# Altium schematic sheet Inductive.SchDoc: WearTech_PMU
size A4; CompanyName: University Of Colorado Boulder; Revision: 1; SheetNumber: 1; SheetTotal: 4
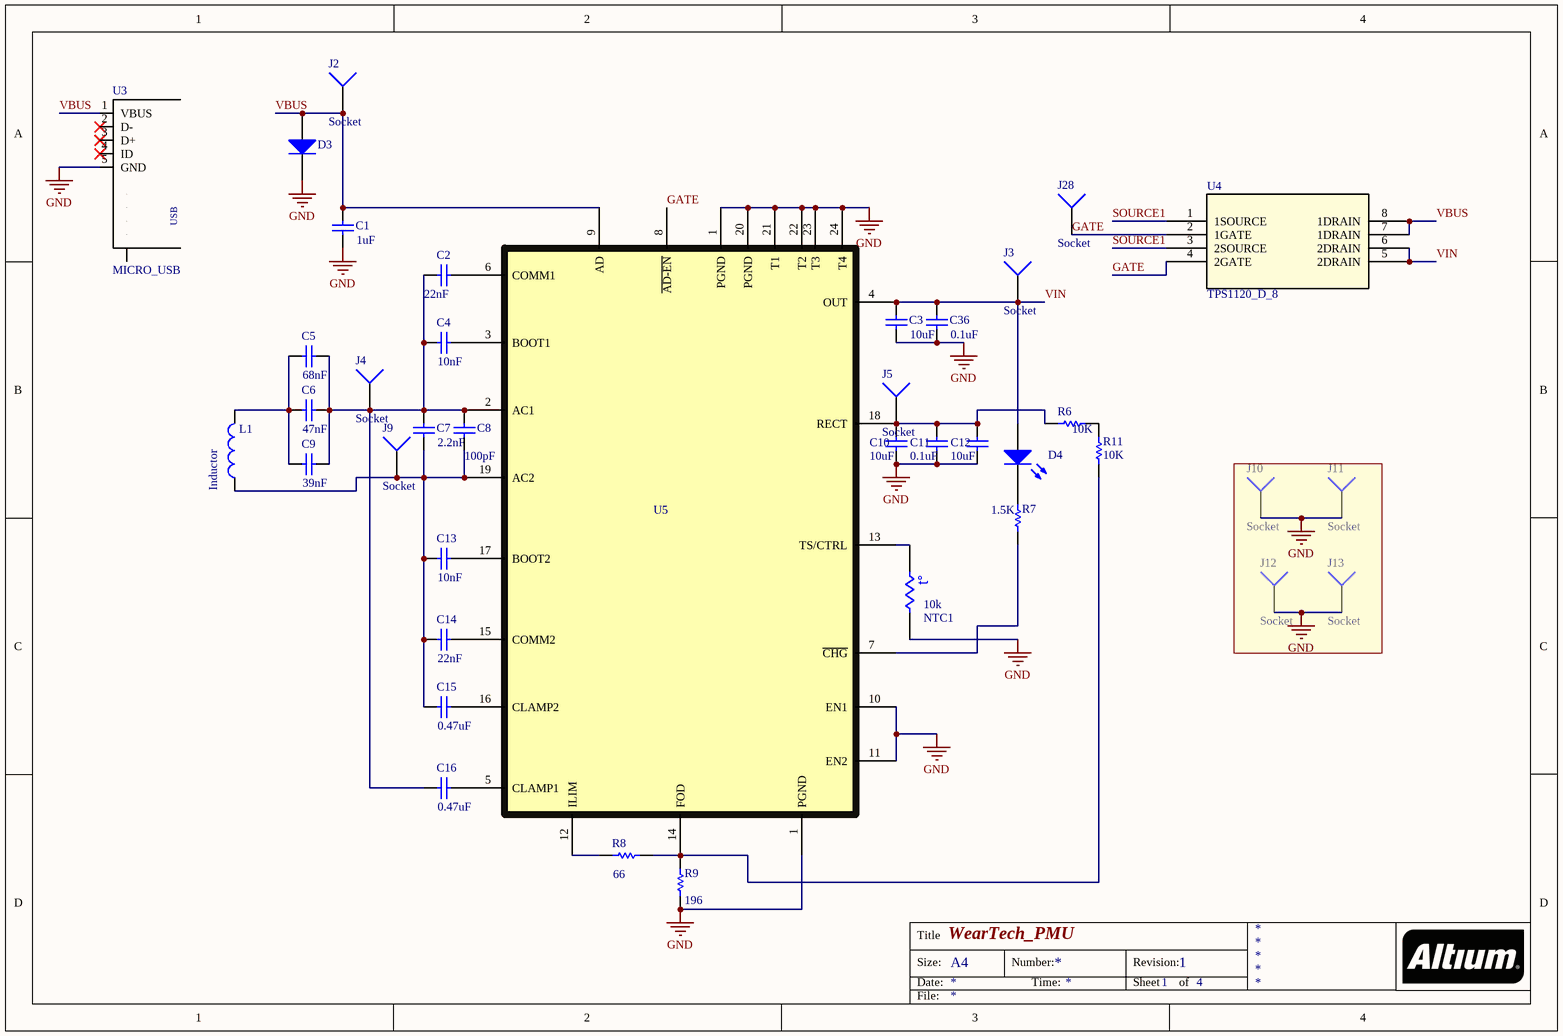
[diagram p0: Inductive.SchDoc]

## Parts
C1  value 1uF  [1608[0603]]  (hidden comment: Cap)
C2  value 22nF  [1608[0603]]  (hidden comment: Cap)
C3  value 10uF  [1608[0603]]  (hidden comment: Cap)
C4  value 10nF  [1608[0603]]  (hidden comment: Cap)
C5  value 68nF  [1608[0603]]  (hidden comment: Cap)
C6  value 47nF  [1608[0603]]  (hidden comment: Cap)
C7  value 2.2nF  [1608[0603]]  (hidden comment: Cap)
C8  value 100pF  [1608[0603]]  (hidden comment: Cap)
C9  value 39nF  [1608[0603]]  (hidden comment: Cap)
C10  value 10uF  [1608[0603]]  (hidden comment: Cap)
C11  value 0.1uF  [1608[0603]]  (hidden comment: Cap)
C12  value 10uF  [1608[0603]]  (hidden comment: Cap)
C13  value 10nF  [1608[0603]]  (hidden comment: Cap)
C14  value 22nF  [1608[0603]]  (hidden comment: Cap)
C15  value 0.47uF  [1608[0603]]  (hidden comment: Cap)
C16  value 0.47uF  [1608[0603]]  (hidden comment: Cap)
C36  value 0.1uF  [1608[0603]]  (hidden comment: Cap)
D3  Diode  [1608[0603]]  (value not drawn)
D4  LED0  [1608[0603]]  (value not drawn)
J2  Socket  [PIN1]
J3  Socket  [PIN1]
J4  Socket  [PIN1]
J5  Socket  [PIN1]
J9  Socket  [PIN1]
J10  Socket  [PIN1]
J11  Socket  [PIN1]
J12  Socket  [PIN1]
J13  Socket  [PIN1]
J28  Socket  [PIN1]
L1  Inductor  [1608[0603]]
NTC1  value 10k  [1608[0603]]  (hidden comment: Res Thermal)
R6  value 10K  [1608[0603]]  (hidden comment: Res1)
R7  value 1.5K  [1608[0603]]  (hidden comment: Res1)
R8  value 66  [1608[0603]]  (hidden comment: Res1)
R9  value 196  [1608[0603]]  (hidden comment: Res1)
R11  value 10K  [1608[0603]]  (hidden comment: Res1)
U3  MICRO_USB  [MICRO USB]
U4  TPS1120_D_8  [BlockSwitch]
U5  BQ51013B  [BQ51013B]  (value not drawn)

## Nets
GND: C1.1 C3.2 C10.2 C11.2 C12.2 C36.2 D3.2(K) J10.1 J11.1 J12.1 J13.1 NTC1.2 R9.2 U3.5(GND) U5.1(PGND) U5.10(EN1) U5.11(EN2) U5.20(PGND) U5.21(T1) U5.22(T2) U5.23(T3) U5.24(T4)
GATE: J28.1 U4.2(1GATE) U4.4(2GATE) U5.8(~{AD-EN})
SOURCE1: U4.1(1SOURCE) U4.3(2SOURCE)
VBUS: C1.2 D3.1(A) J2.1 U3.1(VBUS) U4.7(1DRAIN) U4.8(1DRAIN) U5.9(AD)
VIN: C3.1 C36.1 D4.1(A) J3.1 U4.5(2DRAIN) U4.6(2DRAIN) U5.4(OUT)
NetC2_1: C2.1 U5.6(COMM1)
NetC2_2: C2.2 C4.2 C5.1 C6.1 C7.1 C8.1 C9.1 C16.2 J4.1 U5.2(AC1)
NetC4_1: C4.1 U5.3(BOOT1)
NetC5_2: C5.2 C6.2 C9.2 L1.2
NetC7_2: C7.2 C8.2 C13.2 C14.2 C15.2 J9.1 L1.1 U5.19(AC2)
NetC10_1: C10.1 C11.1 C12.1 J5.1 R6.1 U5.18(RECT)
NetC13_1: C13.1 U5.17(BOOT2)
NetC14_1: C14.1 U5.15(COMM2)
NetC15_1: C15.1 U5.16(CLAMP2)
NetC16_1: C16.1 U5.5(CLAMP1)
NetD4_2: D4.2(K) R7.1
NetNTC1_1: NTC1.1 U5.13(TS/CTRL)
NetR6_2: R6.2 R11.2
NetR7_2: R7.2 U5.7(~{CHG})
NetR8_1: R8.1 U5.12(ILIM)
NetR8_2: R8.2 R9.1 R11.1 U5.14(FOD)

Not connected (* = marked no-connect by the designer): U3 2(D-)* 3(D+)* 4(ID)* M1(S) M2(S) S1(S) S2(S) S3(S) S4(S)

## Notes on the sheet
- Title
- Size:
- Date:
- A4
- Number:
- Time:
- Revision:
- Sheet
- of
- File:
- (in symbol MICRO_USB) USB
- (in symbol Res Thermal) t°

## Library data of the parts
C1 = Cap: Capacitor; Manufacture Part Number: C0603C105K9PACTU; Manufacturer: KEMET; Description: CAP CER 1UF 6.3V X5R 0603; Link: http://psearch.en.murata.com/browser/nosupport/?return=capacitor/product/GRM188R61E105KAAD%23.html; Link: Link; Digi-Key Part Number: 399-7848-1-ND; ComponentLink1URL: Component1URL; ComponentLink1Description: https://search.kemet.com/component-edge/download/datasheet/C0603C105K9PACTU.pdf
C2 C14 = Cap: Capacitor; Manufacture Part Number: CL10B223KA8NNWC; Manufacturer: Samsung Electro-Mechanics; Description: CAP CER 0.022UF 25V X7R 0603; Digi-Key Part Number: 1276-2000-1-ND; ComponentLink1URL: Component1URL; ComponentLink1Description: https://media.digikey.com/pdf/Data%20Sheets/Samsung%20PDFs/CL_Series_MLCC_ds.pdf
  C2: Link: http://psearch.en.murata.com/capacitor/product/GRM188B11E223MA01%23.html
  C14: Link: https://www.digikey.com/product-detail/en/samsung-electro-mechanics/CL10B223KA8NNWC/1276-2000-1-ND/3890086
C3 = Cap: Capacitor; Manufacture Part Number: GRM188R60J106ME47D; Manufacturer: Murata Electronics North America; Description: CAP CER 10UF 6.3V X5R 0603; Link: https://www.digikey.com/product-detail/en/murata-electronics-north-america/GRM188R60J106ME47D/490-3896-1-ND/965938; Digi-Key Part Number: 490-3896-1-ND; ComponentLink1URL: Component1URL; ComponentLink1Description: http://search.murata.co.jp/Ceramy/image/img/A01X/G101/ENG/GRM188R60J106ME47-01.pdf
C4 C13 = Cap: Capacitor; Manufacture Part Number: CL10B103KA8NNNC; Manufacturer: Samsung Electro-Mechanics; Description: CAP CER 10000PF 25V X7R 0603; Digi-Key Part Number: 1276-1132-1-ND; ComponentLink1URL: Component1URL; ComponentLink1Description: https://media.digikey.com/pdf/Data%20Sheets/Samsung%20PDFs/CL_Series_MLCC_ds.pdf
  C4: Link: http://psearch.en.murata.com/capacitor/product/GRM185R61E105MA12%23.html
  C13: Link: https://www.digikey.com/product-detail/en/samsung-electro-mechanics/CL10B103KA8NNNC/1276-1132-1-ND/3889218
C5 = Cap: Capacitor; Manufacture Part Number: CAP CER 0.068UF 25V X7R 0603; Manufacturer: Murata Electronics North America; Description: GRM188R71E683KA01D; Link: https://www.digikey.com/product-detail/en/murata-electronics-north-america/GRM188R71E683KA01D/490-1523-1-ND/587864; Digi-Key Part Number: 490-1523-1-ND; ComponentLink1URL: Component1URL; ComponentLink1Description: http://search.murata.co.jp/Ceramy/image/img/A01X/G101/ENG/GRM188R71E683KA01-01.pdf
C6 = Cap: Capacitor; Manufacture Part Number: CL10B473KA8NFNC; Manufacturer: Samsung; Description: CAP CER 0.047UF 25V X7R 0603; Link: https://www.digikey.com/product-detail/en/samsung-electro-mechanics/CL10B473KA8NFNC/1276-2072-1-ND/3890158; Digi-Key Part Number: 1276-2072-1-ND; ComponentLink1URL: Component1URL; ComponentLink1Description: https://media.digikey.com/pdf/Data%20Sheets/Samsung%20PDFs/CL_Series_MLCC_ds.pdf
C7 = Cap: Capacitor; Manufacture Part Number: C0603C222K3RACTU; Manufacturer: KEMET; Description: CAP CER 2200PF 25V X7R 0603; Link: https://www.digikey.com/product-detail/en/kemet/C0603C222K3RACTU/399-9040-1-ND/3522557; Digi-Key Part Number: 399-9040-1-ND; ComponentLink1URL: Component1URL; ComponentLink1Description: https://search.kemet.com/component-edge/download/datasheet/C0603C222K3RACTU.pdf
C8 = Cap: Capacitor; Manufacture Part Number: C0603C104K3RACTU; Manufacturer: KEMET; Description: CAP CER 0.1UF 25V X7R 0603; Link: https://www.digikey.com/product-detail/en/kemet/C0603C104K3RACTU/399-1281-1-ND/416057; Digi-Key Part Number: 399-1281-1-ND; ComponentLink1URL: Component1URL; ComponentLink1Description: https://search.kemet.com/component-edge/download/datasheet/C0603C104K3RACTU.pdf
C9 = Cap: Capacitor; Manufacture Part Number: C0603C393K3RACTU; Manufacturer: KEMET; Description: CAP CER 0.039UF 25V X7R 0603; Link: https://www.digikey.com/product-detail/en/kemet/C0603C393K3RACTU/399-7914-1-ND/3471637; Digi-Key Part Number: 399-7914-1-ND; ComponentLink1URL: Component1URL; ComponentLink1Description: https://search.kemet.com/component-edge/download/datasheet/C0603C393K3RACTU.pdf
C10 = Cap: Capacitor; Manufacture Part Number: GRM188R61C106KAALD; Manufacturer: Murata Electronics North AmericaMurata Electronics North America; Description: CAP CER 10UF 16V X5R 0603; Link: https://www.digikey.com/product-detail/en/murata-electronics-north-america/GRM188R61C106KAALD/490-10728-1-ND/5251372; Digi-Key Part Number: 490-10728-1-ND; ComponentLink1URL: Component1URL; ComponentLink1Description: http://search.murata.co.jp/Ceramy/image/img/A01X/G101/ENG/GRM188R61C106KAAL-01.pdf
C11 = Cap: Capacitor; Manufacture Part Number: CAP CER 0.1UF 16V X7R 0603; Description: 0603YC104JAT2A; Link: https://www.digikey.com/product-detail/en/avx-corporation/0603YC104JAT2A/478-3726-1-ND/1116424; Digi-Key Part Number: Digi-Key Part Number; ComponentLink1URL: Component1URL; ComponentLink1Description: cOM; Manufacturer: Manufacturer
C12 = Cap: Capacitor; Manufacture Part Number: GRM188R61C106KAALD; Manufacturer: Murata Electronics North America; Description: CAP CER 10UF 16V X5R 0603; Link: https://www.digikey.com/product-detail/en/murata-electronics-north-america/GRM188R61C106KAALD/490-10728-1-ND/5251372; Digi-Key Part Number: 490-10728-1-ND; ComponentLink1URL: Component1URL; ComponentLink1Description: http://search.murata.co.jp/Ceramy/image/img/A01X/G101/ENG/GRM188R61C106KAAL-01.pdf
C15 = Cap: Capacitor; Manufacture Part Number: CAP CER 0.47UF 25V X7R 0603; Manufacturer: Murata Electronics North America; Description: GRM188R71E474KA12D; Link: https://www.digikey.com/product-detail/en/murata-electronics-north-america/GRM188R71E474KA12D/490-3291-1-ND/702832; Digi-Key Part Number: 490-3291-1-ND; ComponentLink1URL: Component1URL; ComponentLink1Description: http://search.murata.co.jp/Ceramy/image/img/A01X/G101/ENG/GRM188R71E474KA12-01.pdf
C16 = Cap: Capacitor; Manufacture Part Number: GRM188R71E474KA12D; Manufacturer: Murata Electronics North America; Description: CAP CER 0.47UF 25V X7R 0603; Link: https://www.digikey.com/product-detail/en/murata-electronics-north-america/GRM188R71E474KA12D/490-3291-1-ND/702832; Digi-Key Part Number: 490-3291-1-ND; ComponentLink1URL: Component1URL; ComponentLink1Description: http://search.murata.co.jp/Ceramy/image/img/A01X/G101/ENG/GRM188R71E474KA12-01.pdf
C36 = Cap: Capacitor; Manufacture Part Number: GRM188R70J104KA01D; Manufacturer: Murata Electronics North America; Description: CAP CER 0.1UF 6.3V X7R 0603; Link: https://www.digikey.com/product-detail/en/murata-electronics-north-america/GRM188R70J104KA01D/490-9730-1-ND/4934899; Digi-Key Part Number: 490-9730-1-ND; ComponentLink1URL: Component1URL; ComponentLink1Description: http://search.murata.co.jp/Ceramy/image/img/A01X/G101/ENG/GRM188R70J104KA01-01.pdf
D3 = Diode: Default Diode; Manufacture Part Number: SMF05CT1G; Manufacturer: ON Semiconductor; Description: TVS DIODE 5VWM 12.5VC SC88; Link: https://www.digikey.com/product-detail/en/SMF05CT1G/SMF05CT1GOSCT-ND/1967287; Digi-Key Part Number: SMF05CT1GOSCT-ND; ComponentLink1URL: Component1URL; ComponentLink1Description: http://www.onsemi.com/pub/Collateral/SMF05C-D.PDF
D4 = LED0: Typical INFRARED GaAs LED; Manufacture Part Number: LO L29K-H2K1-24-Z; Manufacturer: OSRAM Opto Semiconductors Inc.; Description: LED ORANGE DIFFUSED 0603 SMD; Link: https://www.digikey.com/product-detail/en/yageo/RC0603JR-0710KL/311-10KGRCT-ND/729647; Digi-Key Part Number: 475-2740-1-ND; ComponentLink1URL: Component1URL; ComponentLink1Description: http://www.osram-os.com/Graphics/XPic0/00077105_0.pdf
J2-J5 J9-J13 J28 = Socket: Manufacture Part Number: 68000-200HLF; Manufacturer: Amphenol FCI; Description: Description; Link: https://www.digikey.com/product-detail/en/amphenol-fci/68000-200HLF/609-5099-1-ND/5968545; Digi-Key Part Number: 609-5099-1-ND; ComponentLink1URL: Component1URL; ComponentLink1Description: http://cdn.amphenol-icc.com/media/wysiwyg/files/drawing/68000.pdf
L1 = Inductor: RX 1 COIL 1 LAYER 10.7UH; Manufacturer: Vishay Dale; Value: 10mH; Manufacture Part Number: Manufacture Part Number; Link: https://www.digikey.com/product-detail/en/vishay-dale/IWAS3827ECEB100J50/541-1695-ND/3641244; Digi-Key Part Number: 541-1695-ND; ComponentLink1URL: Component1URL; ComponentLink1Description: http://www.vishay.com/docs/34338/iwas3827.pdf
NTC1 = Res Thermal: Thermistor; Manufacturer: Yageo; Description: RC0603JR-0710KL; Manufacture Part Number: RC0603JR-0710KL; Link: https://www.digikey.com/product-detail/en/yageo/RC0603JR-0710KL/311-10KGRCT-ND/729647; Digi-Key Part Number: 311-10KGRCT-ND; ComponentLink1URL: Component1URL; ComponentLink1Description: http://www.yageo.com.tw/exep/pages/download/literatures/PYu-R_INT-thick_7.pdf
R6 R11 = Res1: Resistor; Manufacture Part Number: RC0603JR-0710KL; Manufacturer: Yageo; Description: RES SMD 10K OHM 5% 1/10W 0603; Link: https://www.digikey.com/product-detail/en/yageo/RC0603JR-0710KL/311-10KGRCT-ND/729647; Digi-Key Part Number: 311-10KGRCT-ND; ComponentLink1URL: Component1URL; ComponentLink1Description: http://www.yageo.com.tw/exep/pages/download/literatures/PYu-R_INT-thick_7.pdf
R7 = Res1: Resistor; Manufacture Part Number: RC0603JR-071K5L; Manufacturer: Yageo; Description: RES SMD 1.5K OHM 5% 1/10W 0603; Link: https://www.digikey.com/product-detail/en/yageo/RC0603JR-071K5L/311-1.5KGRCT-ND/729636; Digi-Key Part Number: 311-1.5KGRCT-ND; ComponentLink1URL: Component1URL; ComponentLink1Description: http://www.yageo.com.tw/exep/pages/download/literatures/PYu-R_INT-thick_7.pdf
R8 = Res1: Resistor; Manufacture Part Number: RC0603FR-0766R5L; Manufacturer: Yageo; Description: RES SMD 66.5 OHM 1% 1/10W 0603; Link: https://www.digikey.com/product-detail/en/yageo/RC0603FR-0766R5L/311-66.5HRCT-ND/730294; Digi-Key Part Number: 311-66.5HRCT-ND; ComponentLink1URL: Component1URL; ComponentLink1Description: http://www.yageo.com/documents/recent/PYu-RC_Group_51_RoHS_L_8.pdf
R9 = Res1: Resistor; Manufacture Part Number: RC0603FR-07196RL; Manufacturer: Yageo; Description: RES SMD 196 OHM 1% 1/10W 0603; Link: https://www.digikey.com/product-detail/en/yageo/RC0603FR-07196RL/311-196HRCT-ND/729953; Digi-Key Part Number: 311-196HRCT-ND; ComponentLink1URL: Component1URL; ComponentLink1Description: http://www.yageo.com/documents/recent/PYu-RC_Group_51_RoHS_L_8.pdf
U3 = MICRO_USB: CONN USB MICRO B RECPT SMT R/A; Manufacture Part Number: 10118192-0001LF; Manufacturer: Amphenol FCI; Link: https://www.digikey.com/product-detail/en/amphenol-fci/10118192-0001LF/609-4613-1-ND/2785378; Digi-Key Part Number: 609-4613-1-ND; ComponentLink1URL: Component1URL; ComponentLink1Description: http://cdn.amphenol-icc.com/media/wysiwyg/files/drawing/10118192.pdf
U4 = TPS1120_D_8: Manufacturer: Texas Instruments; Description: Description; Manufacture Part Number: Manufacture Part Number; Link: https://www.digikey.com/products/en/discrete-semiconductor-products/transistors-fets-mosfets-arrays/289?k=tps1120&k=&pkeyword=tps1120&pv7=2&FV=ffe00121&mnonly=0&ColumnSort=0&page=1&stock=1&quantity=0&ptm=0&fid=0&pageSize=25; Digi-Key Part Number: 296-1352-1-ND; ComponentLink1URL: Component1URL; ComponentLink1Description: http://www.ti.com/lit/gpn/TPS1120
U5 = BQ51013B: Manufacture Part Number: BQ51013BRHLR; Manufacturer: Texas Instruments; Description: IC WIRELESS PWR RCVR 20QFN; Link: https://www.digikey.com/product-detail/en/texas-instruments/BQ51013BRHLR/296-38885-1-ND/5142996; Digi-Key Part Number: 296-38885-1-ND; ComponentLink1URL: Component1URL; ComponentLink1Description: http://www.ti.com/lit/ds/symlink/bq51013b.pdf